# EAGLE design BMS Segment (EAGLE 7.7.0)
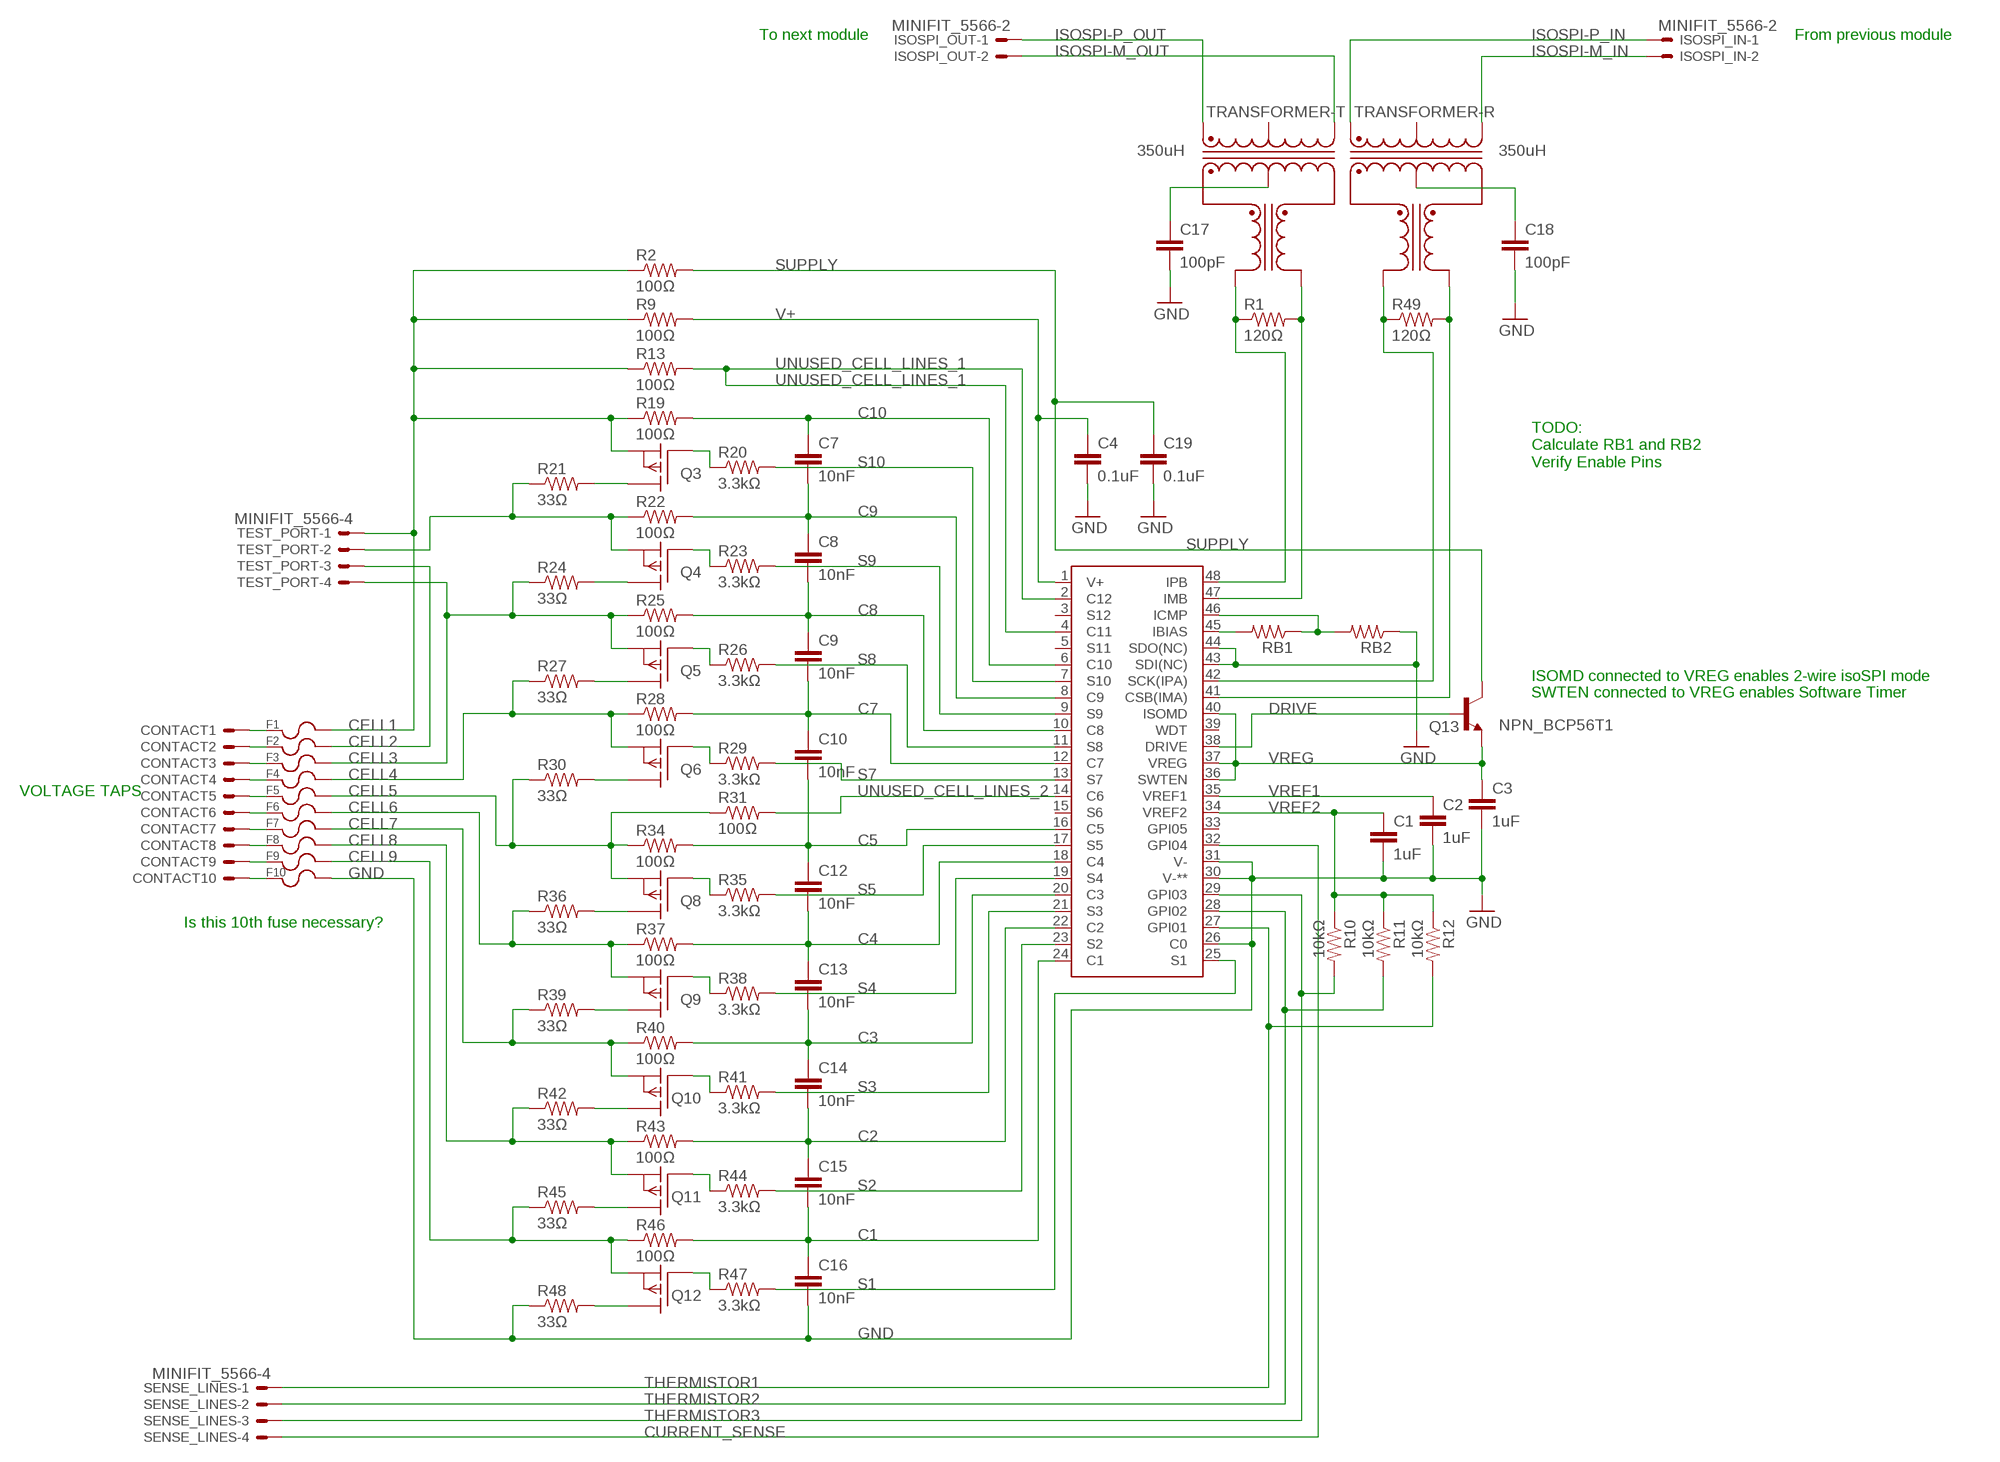
[diagram p0: schematic, sheet 1]

## Parts
C1  1uF  CAP0805  [0805]
C2  1uF  CAP0805  [0805]
C3  1uF  CAP0805  [0805]
C4  0.1uF  CAP0805  [0805]
C7  10nF  CAP0805  [0805]
C8  10nF  CAP0805  [0805]
C9  10nF  CAP0805  [0805]
C10  10nF  CAP0805  [0805]
C12  10nF  CAP0805  [0805]
C13  10nF  CAP0805  [0805]
C14  10nF  CAP0805  [0805]
C15  10nF  CAP0805  [0805]
C16  10nF  CAP0805  [0805]
C17  100pF  CAP0805  [0805]
C18  100pF  CAP0805  [0805]
C19  0.1uF  CAP0805  [0805]
CONTACT1  SPRING_CONTACT  [S1791-42R]
CONTACT2  SPRING_CONTACT  [S1791-42R]
CONTACT3  SPRING_CONTACT  [S1791-42R]
CONTACT4  SPRING_CONTACT  [S1791-42R]
CONTACT5  SPRING_CONTACT  [S1791-42R]
CONTACT6  SPRING_CONTACT  [S1791-42R]
CONTACT7  SPRING_CONTACT  [S1791-42R]
CONTACT8  SPRING_CONTACT  [S1791-42R]
CONTACT9  SPRING_CONTACT  [S1791-42R]
CONTACT10  SPRING_CONTACT  [S1791-42R]
F1  0751.0110_FUSE_CLIP  [0751.0110]
F2  0751.0110_FUSE_CLIP  [0751.0110]
F3  0751.0110_FUSE_CLIP  [0751.0110]
F4  0751.0110_FUSE_CLIP  [0751.0110]
F5  0751.0110_FUSE_CLIP  [0751.0110]
F6  0751.0110_FUSE_CLIP  [0751.0110]
F7  0751.0110_FUSE_CLIP  [0751.0110]
F8  0751.0110_FUSE_CLIP  [0751.0110]
F9  0751.0110_FUSE_CLIP  [0751.0110]
F10  0751.0110_FUSE_CLIP  [0751.0110]
ISOSPI_IN  MINIFIT_5566-2  [MINIFIT_5566-2]
ISOSPI_OUT  MINIFIT_5566-2  [MINIFIT_5566-2]
Q3  P-CHANNEL_MOSFET_DMP3099L-7  [SOT23]
Q4  P-CHANNEL_MOSFET_DMP3099L-7  [SOT23]
Q5  P-CHANNEL_MOSFET_DMP3099L-7  [SOT23]
Q6  P-CHANNEL_MOSFET_DMP3099L-7  [SOT23]
Q8  P-CHANNEL_MOSFET_DMP3099L-7  [SOT23]
Q9  P-CHANNEL_MOSFET_DMP3099L-7  [SOT23]
Q10  P-CHANNEL_MOSFET_DMP3099L-7  [SOT23]
Q11  P-CHANNEL_MOSFET_DMP3099L-7  [SOT23]
Q12  P-CHANNEL_MOSFET_DMP3099L-7  [SOT23]
Q13  NPN_BCP56T1  [SOT223]
R1  120Ω  RESISTOR0805-RES  [0805]
R2  100Ω  RESISTOR0805-RES  [0805]
R9  100Ω  RESISTOR0805-RES  [0805]
R10  10kΩ  RESISTOR0805-RES  [0805]
R11  10kΩ  RESISTOR0805-RES  [0805]
R12  10kΩ  RESISTOR0805-RES  [0805]
R13  100Ω  RESISTOR0805-RES  [0805]
R19  100Ω  RESISTOR0805-RES  [0805]
R20  3.3kΩ  RESISTOR0805-RES  [0805]
R21  33Ω  RESISTOR2512  [R2512]
R22  100Ω  RESISTOR0805-RES  [0805]
R23  3.3kΩ  RESISTOR0805-RES  [0805]
R24  33Ω  RESISTOR2512  [R2512]
R25  100Ω  RESISTOR0805-RES  [0805]
R26  3.3kΩ  RESISTOR0805-RES  [0805]
R27  33Ω  RESISTOR2512  [R2512]
R28  100Ω  RESISTOR0805-RES  [0805]
R29  3.3kΩ  RESISTOR0805-RES  [0805]
R30  33Ω  RESISTOR2512  [R2512]
R31  100Ω  RESISTOR0805-RES  [0805]
R34  100Ω  RESISTOR0805-RES  [0805]
R35  3.3kΩ  RESISTOR0805-RES  [0805]
R36  33Ω  RESISTOR2512  [R2512]
R37  100Ω  RESISTOR0805-RES  [0805]
R38  3.3kΩ  RESISTOR0805-RES  [0805]
R39  33Ω  RESISTOR2512  [R2512]
R40  100Ω  RESISTOR0805-RES  [0805]
R41  3.3kΩ  RESISTOR0805-RES  [0805]
R42  33Ω  RESISTOR2512  [R2512]
R43  100Ω  RESISTOR0805-RES  [0805]
R44  3.3kΩ  RESISTOR0805-RES  [0805]
R45  33Ω  RESISTOR2512  [R2512]
R46  100Ω  RESISTOR0805-RES  [0805]
R47  3.3kΩ  RESISTOR0805-RES  [0805]
R48  33Ω  RESISTOR2512  [R2512]
R49  120Ω  RESISTOR0805-RES  [0805]
RB1  RESISTOR0805-RES  [0805]
RB2  RESISTOR0805-RES  [0805]
SENSE_LINES  MINIFIT_5566-4  [MINIFIT_5566-4]
TEST_PORT  MINIFIT_5566-4  [MINIFIT_5566-4]
TRANSFORMER-  350uH  TRANSFORMER_749010013  [749010013]
U$2  LTC6804-1  [LTC6804]

## Nets
C1: C15.2 C16.1 R46.2 U$2.24(C1)
C2: C14.2 C15.1 R43.2 U$2.22(C2)
C3: C13.2 C14.1 R40.2 U$2.20(C3)
C4: C12.2 C13.1 R37.2 U$2.18(C4)
C5: C10.2 C12.1 R34.2 U$2.16(C5)
C7: C9.2 C10.1 R28.2 U$2.12(C7)
C8: C8.2 C9.1 R25.2 U$2.10(C8)
C9: C7.2 C8.1 R22.2 U$2.8(C9)
C10: C7.1 R19.2 U$2.6(C10)
CELL1: F1.R1 F1.R2 Q3.2(S) R2.1 R9.1 R13.1 R19.1 TEST_PORT.1
CELL2: F2.R1 F2.R2 Q4.2(S) R21.1 R22.1 TEST_PORT.2 TEST_PORT.3
CELL3: F3.R1 F3.R2 Q5.2(S) R24.1 R25.1 TEST_PORT.4
CELL4: F4.R1 F4.R2 Q6.2(S) R27.1 R28.1
CELL5: F5.R1 F5.R2 Q8.2(S) R30.1 R31.1 R34.1
CELL6: F6.R1 F6.R2 Q9.2(S) R36.1 R37.1
CELL7: F7.R1 F7.R2 Q10.2(S) R39.1 R40.1
CELL8: F8.R1 F8.R2 Q11.2(S) R42.1 R43.1
CELL9: F9.R1 F9.R2 Q12.2(S) R45.1 R46.1
CURRENT_SENSE: SENSE_LINES.4 U$2.32(GPI04)
DRIVE: Q13.1(BASE) U$2.38(DRIVE)
GND: C1.2 C2.2 C3.2 C4.2 C16.2 C17.2 C18.2 C19.2 F10.R1 F10.R2 R48.1 RB2.1 U$2.26(C0) U$2.30(V-**) U$2.31(V-) U$2.43(SDI(NC)) U$2.44(SDO(NC))
ISOSPI-M_IN: ISOSPI_IN.2 TRANSFORMER-.8(R:D-)
ISOSPI-M_OUT: ISOSPI_OUT.2 TRANSFORMER-.3(T:D-)
ISOSPI-P_IN: ISOSPI_IN.1 TRANSFORMER-.6(R:D+)
ISOSPI-P_OUT: ISOSPI_OUT.1 TRANSFORMER-.1(T:D+)
N$1: C18.1 TRANSFORMER-.10(R:CX)
N$2: C17.1 TRANSFORMER-.15(T:CX)
N$4: RB1.2 U$2.45(IBIAS)
N$5: R1.1 TRANSFORMER-.16(T:X+) U$2.48(IPB)
N$7: RB1.1 RB2.2 U$2.46(ICMP)
N$8: R49.1 TRANSFORMER-.11(R:X+) U$2.42(SCK(IPA))
N$9: R49.2 TRANSFORMER-.9(R:X-) U$2.41(CSB(IMA))
N$14: CONTACT1.P$1(S) F1.L1 F1.L2
N$15: Q3.1(G) R20.1
N$16: CONTACT2.P$1(S) F2.L1 F2.L2
N$17: CONTACT3.P$1(S) F3.L1 F3.L2
N$18: Q3.3(D) R21.2
N$19: CONTACT4.P$1(S) F4.L1 F4.L2
N$20: Q8.1(G) R35.1
N$22: Q9.1(G) R38.1
N$23: CONTACT5.P$1(S) F5.L1 F5.L2
N$24: CONTACT6.P$1(S) F6.L1 F6.L2
N$25: Q4.3(D) R24.2
N$26: CONTACT7.P$1(S) F7.L1 F7.L2
N$27: Q10.1(G) R41.1
N$28: Q11.1(G) R44.1
N$29: Q12.1(G) R47.1
N$30: Q5.3(D) R27.2
N$31: CONTACT8.P$1(S) F8.L1 F8.L2
N$32: CONTACT9.P$1(S) F9.L1 F9.L2
N$33: CONTACT10.P$1(S) F10.L1 F10.L2
N$36: Q6.3(D) R30.2
N$42: R1.2 TRANSFORMER-.14(T:X-) U$2.47(IMB)
N$43: Q8.3(D) R36.2
N$51: Q9.3(D) R39.2
N$53: Q10.3(D) R42.2
N$61: Q11.3(D) R45.2
N$66: Q12.3(D) R48.2
N$68: Q4.1(G) R23.1
N$69: Q5.1(G) R26.1
N$70: Q6.1(G) R29.1
S1: R47.2 U$2.25(S1)
S2: R44.2 U$2.23(S2)
S3: R41.2 U$2.21(S3)
S4: R38.2 U$2.19(S4)
S5: R35.2 U$2.17(S5)
S7: R29.2 U$2.13(S7)
S8: R26.2 U$2.11(S8)
S9: R23.2 U$2.9(S9)
S10: R20.2 U$2.7(S10)
SUPPLY: C19.1 Q13.2(COLLECTOR) Q13.4(COLLECTOR) R2.2
THERMISTOR1: R12.2 SENSE_LINES.1 U$2.27(GPI01)
THERMISTOR2: R11.2 SENSE_LINES.2 U$2.28(GPI02)
THERMISTOR3: R10.2 SENSE_LINES.3 U$2.29(GPI03)
UNUSED_CELL_LINES_1: R13.2 U$2.2(C12) U$2.4(C11)
UNUSED_CELL_LINES_2: R31.2 U$2.14(C6)
V+: C4.1 R9.2 U$2.1(V+)
VREF1: C2.1 U$2.35(VREF1)
VREF2: C1.1 R10.1 R11.1 R12.1 U$2.34(VREF2)
VREG: C3.1 Q13.3(EMITTER) U$2.36(SWTEN) U$2.37(VREG) U$2.40(ISOMD)
Unconnected: TRANSFORMER-.2(T:CD) TRANSFORMER-.7(R:CD) U$2.3(S12) U$2.5(S11) U$2.15(S6) U$2.33(GPI05) U$2.39(WDT)

## Notes on the sheet
- To next module | From previous module
- TODO:
  Calculate RB1 and RB2
  Verify Enable Pins
- ISOMD connected to VREG enables 2-wire isoSPI mode
- SWTEN connected to VREG enables Software Timer
- VOLTAGE TAPS
- Is this 10th fuse necessary?

## Library data of the parts
C1-C4 C7-C10 C12-C19 = HyTechDevices:CAP: Capacitor Standard 0603 ceramic capacitor, and 0.1" leaded capacitor.
CONTACT1-CONTACT10 = HyTechDevices:SPRING_CONTACT: Harwin Surface Mount Spring Contact Datasheet <http://www.mouser.com/ds/2/181/S1791-42R-351038.pdf>
F1-F10 = HyTechDevices:0751.0110_FUSE_CLIP: Schurter 0751.0110 Brass Fuse Clip Datasheet <http://www.mouser.com/ds/2/358/typ_OG__Clip__5x20-2553.pdf>
ISOSPI_IN ISOSPI_OUT = HyTechDevices:MINIFIT_5566-2: Mini-Fit Junior connector 2 pole Source: http://www.molex.com; OC_FARNELL: 1822072; OC_NEWARK: unknown
Q3-Q6 Q8-Q12 = HyTechDevices:P-CHANNEL_MOSFET_DMP3099L-7: Diodes Incorporated P-Channel Enhancement Mode MOSFET Datasheet <http://www.mouser.com/ds/2/115/DMP3099L-266220.pdf>
Q13 = HyTechDevices:NPN_BCP56T1: ON Semiconductor BCP56 Series NPN Silicon Epitaxial Transistor Datasheet <http://www.mouser.com/ds/2/308/BCP56T1-D-104805.pdf>
R1 R2 R9-R13 R19-R31 R34-R49 RB1 RB2 = HyTechDevices:RESISTOR: Resistor Basic schematic elements and footprints for 0603, 1206, and PTH resistors.
SENSE_LINES TEST_PORT = HyTechDevices:MINIFIT_5566-4: Mini-Fit Junior connector 4 pole Source: http://www.molex.com; OC_FARNELL: unknown; OC_NEWARK: unknown
TRANSFORMER- = HyTechDevices:TRANSFORMER_749010013: Wurth Electronics Midcom 749010013 10/100BaseTX Ethernet Transformer Datasheet <http://www.mouser.com/ds/2/445/749010013-311000.pdf> Mouser Page <http://www.mouser.com/ProductDetail/Wurth-Electronics-Midcom/749010013/?qs=40TFAHZMFvcjCZphxWYgVw%3D%3D>
U$2 = HyTechDevices:LTC6804-1

## Board
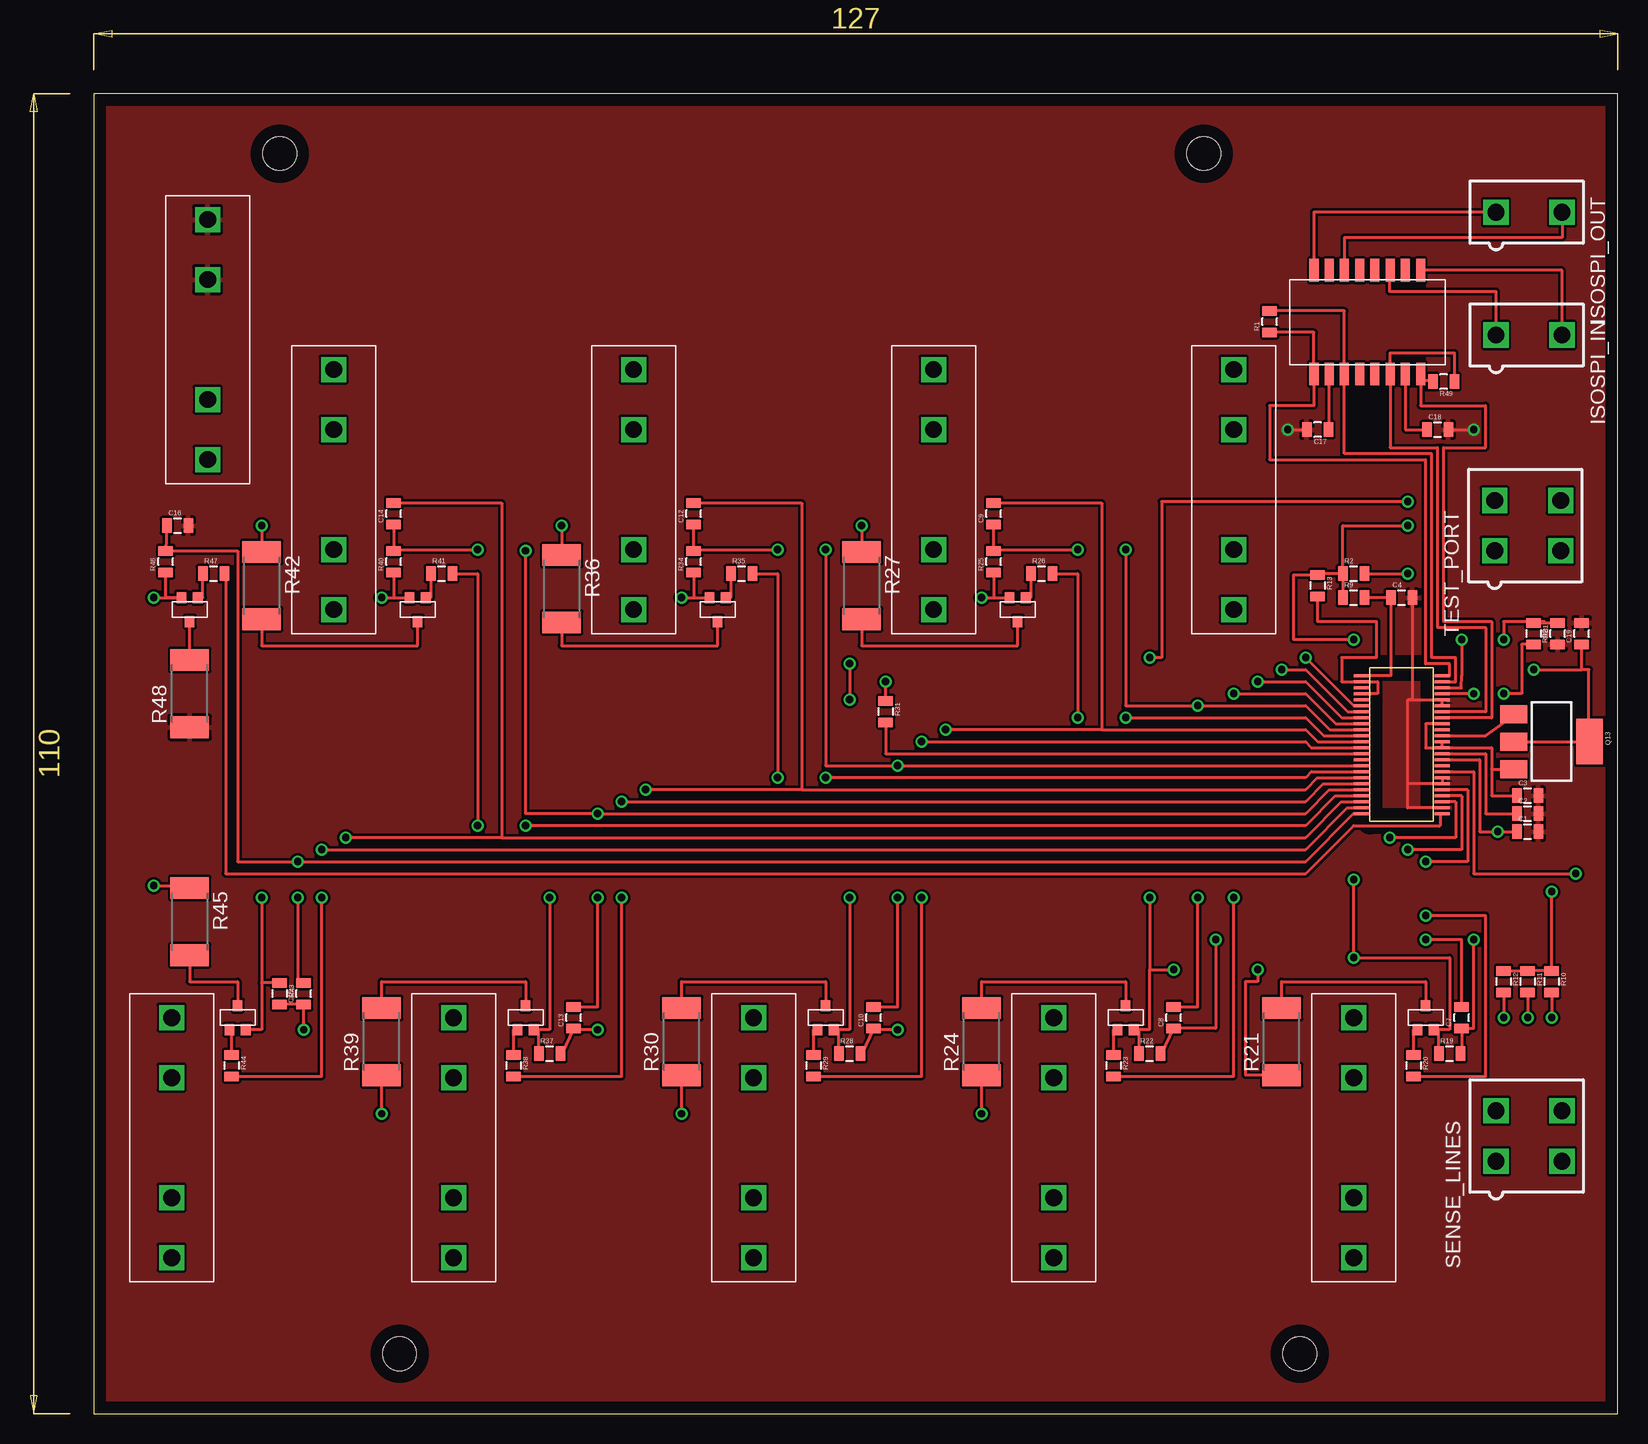
[diagram p1: board, top side]
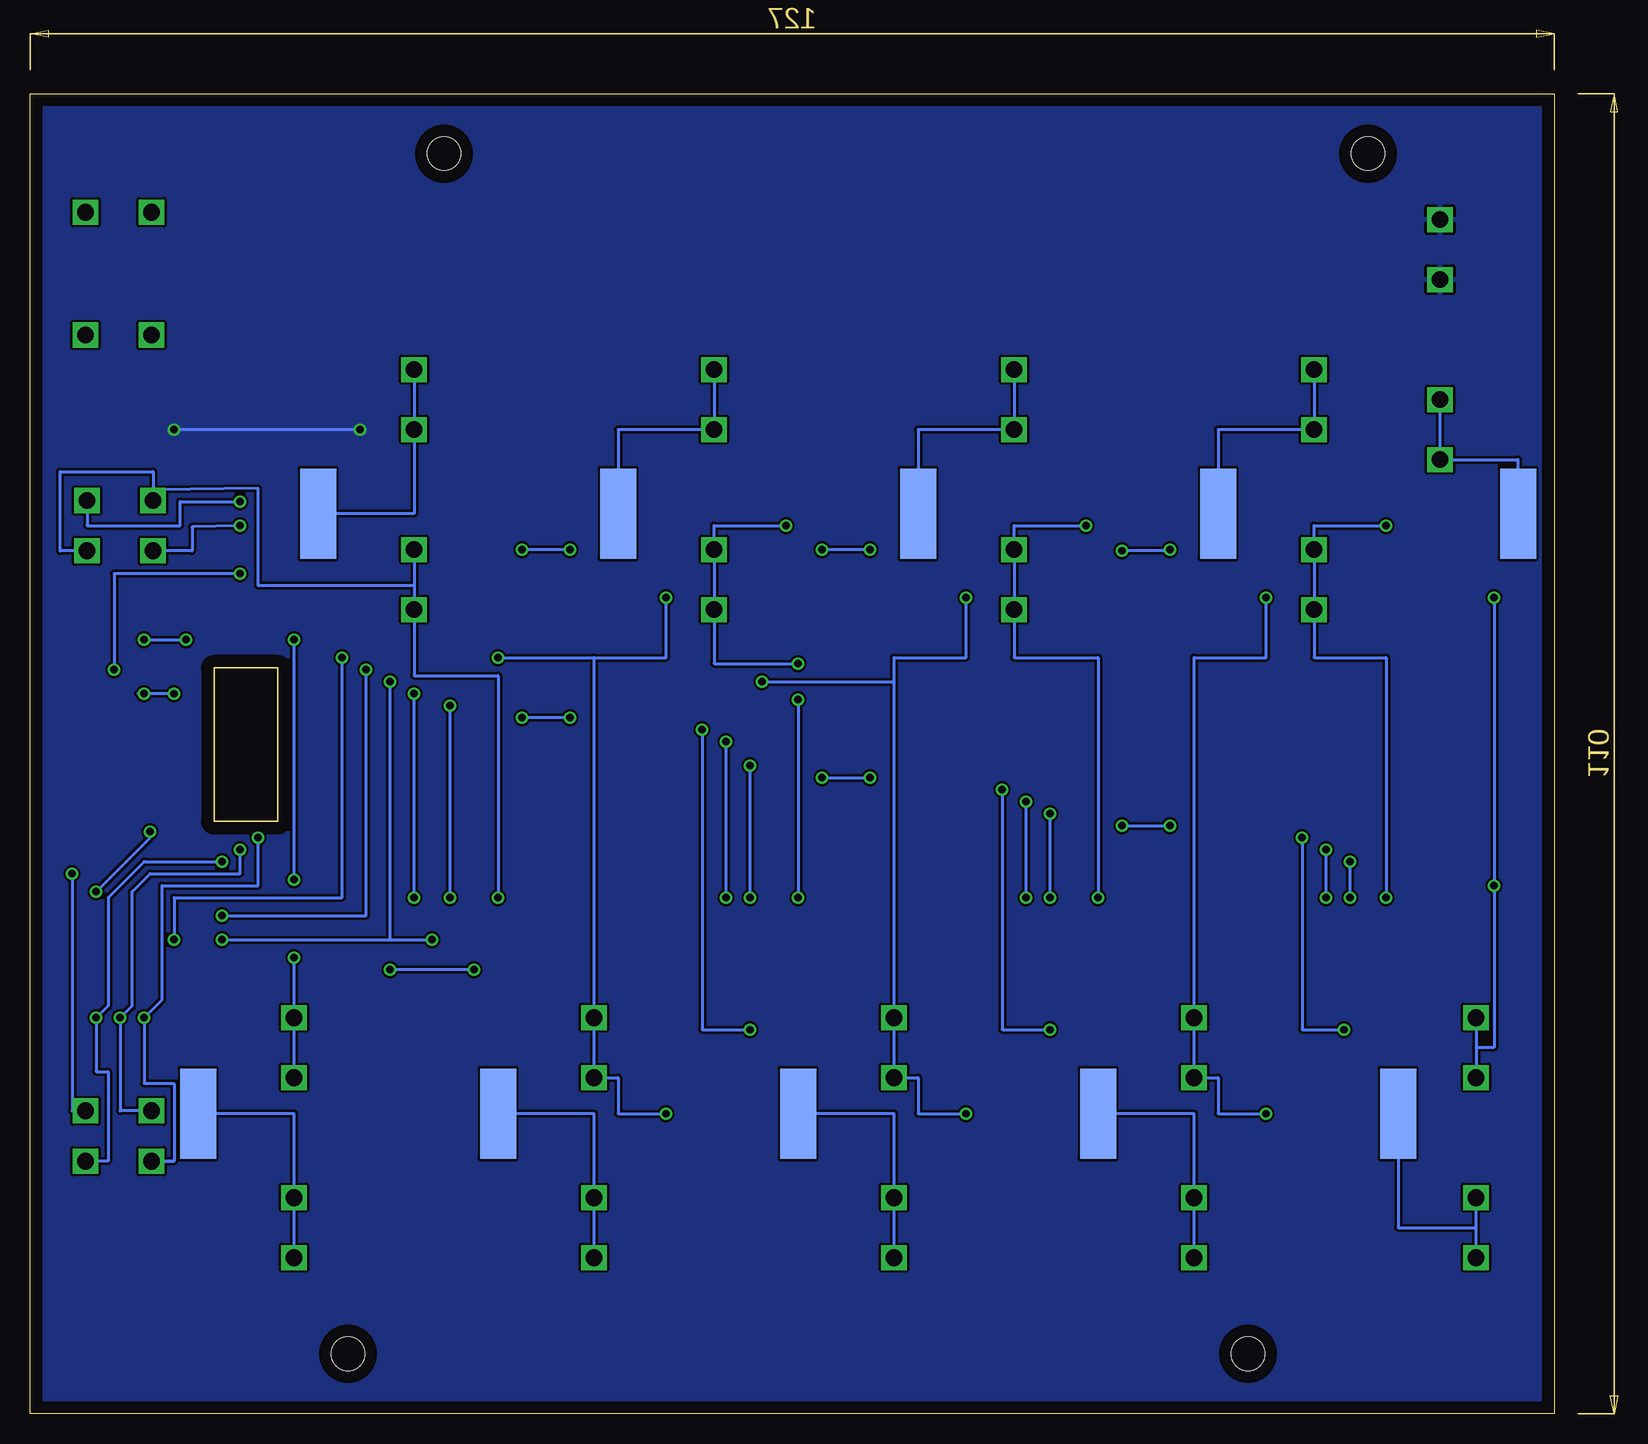
[diagram p2: board, bottom side, seen from below]

Size 127 x 110 mm. Coordinates in mm from the lower left corner, seen from the top.
Outline: 0,0 127,0 127,110 0,110 0,0
Copper layers (1*16): Top 0.035mm / dielectric 1.5mm / Bottom 0.035mm
Design rules "default": minimum track width 10mil, minimum drill 24mil, track to track 8mil, track to pad 8mil, pad to pad 8mil, via to via 8mil, smd to smd 8mil, copper to edge 40mil, drill to drill 8mil, minimum pad ring 10mil, minimum via ring 8mil, stop-mask expansion 4mil, vias tented up to drill 0mil, thermal gap 10mil
Holes 2.8 mm at 100.5,5 25.5,5 92.5,105 15.5,105

### Footprints (pad centres in the part's own frame; a part is rotated, then mirrored left to right if it is on the bottom)
0805 = smd 0.8 x 1.2: 1 -0.9,0; 2 0.9,0
S1791-42R = smd 7.5 x 3: P$1 0,0
0751.0110 = drill 1.4 square: L1 -10,0; L2 -5,0; R1 5,0; R2 10,0
MINIFIT_5566-2 = drill 1.4 square: 1 0,-2.75; 2 0,2.75
SOT23 = smd 0.8 x 0.9: 1 -0.675,-1; 2 0.675,-1; 3 0,1
SOT223 = smd 1.5 x 2.235: 1 -2.3,-3.15; 2 0,-3.15; 3 2.3,-3.15 | smd 3.8 x 2.2: 4 0,3.15
R2512 = smd 1.8 x 3.2: 1 -2.8,0; 2 2.8,0
MINIFIT_5566-4 = drill 1.4 square: 1 2.1,-2.75; 2 -2.1,-2.75; 3 2.1,2.75; 4 -2.1,2.75
749010013 = smd 1.905 x 0.762: 1 4.318,4.445; 2 4.318,3.175; 3 4.318,1.905; 4 4.318,0.635; 5 4.318,-0.635; 6 4.318,-1.905; 7 4.318,-3.175; 8 4.318,-4.445; 9 -4.318,-4.445; 10 -4.318,-3.175; 11 -4.318,-1.905; 12 -4.318,-0.635; 13 -4.318,0.635; 14 -4.318,1.905; 15 -4.318,3.175; 16 -4.318,4.445
LTC6804 = smd 0.25 x 1.25: 1 -5.75,-3.375; 2 -5.25,-3.375; 3 -4.75,-3.375; 4 -4.25,-3.375; 5 -3.75,-3.375; 6 -3.25,-3.375; 7 -2.75,-3.375; 8 -2.25,-3.375; 9 -1.75,-3.375; 10 -1.25,-3.375; 11 -0.75,-3.375; 12 -0.25,-3.375; 13 0.25,-3.375; 14 0.75,-3.375; 15 1.25,-3.375; 16 1.75,-3.375; 17 2.25,-3.375; 18 2.75,-3.375; 19 3.25,-3.375; 20 3.75,-3.375; 21 4.25,-3.375; 22 4.75,-3.375; 23 5.25,-3.375; 24 5.75,-3.375; 25 5.75,3.375; 26 5.25,3.375; 27 4.75,3.375; 28 4.25,3.375; 29 3.75,3.375; 30 3.25,3.375; 31 2.75,3.375; 32 2.25,3.375; 33 1.75,3.375; 34 1.25,3.375; 35 0.75,3.375; 36 0.25,3.375; 37 -0.25,3.375; 38 -0.75,3.375; 39 -1.25,3.375; 40 -1.75,3.375; 41 -2.25,3.375; 42 -2.75,3.375; 43 -3.25,3.375; 44 -3.75,3.375; 45 -4.25,3.375; 46 -4.75,3.375; 47 -5.25,3.375; 48 -5.75,3.375

### Placement (x,y rotation side)
C1  119.5,48.5 0 top
C2  119.5,50 0 top
C3  119.5,51.5 0 top
C4  109,68 0 top
C7  114,33 90 top
C8  90,33 90 top
C9  75,75 90 top
C10  65,33 90 top
C12  50,75 90 top
C13  40,33 90 top
C14  25,75 90 top
C15  17.5,35 90 top
C16  7,74 0 top
C17  102,82 180 top
C18  112,82 0 top
C19  124,65 90 top
CONTACT1  113,25 270 bottom
CONTACT2  103,75 270 bottom
CONTACT3  88,25 90 bottom
CONTACT4  78,75 90 bottom
CONTACT5  63,25 90 bottom
CONTACT6  53,75 270 bottom
CONTACT7  38,25 270 bottom
CONTACT8  28,75 90 bottom
CONTACT9  13,25 90 bottom
CONTACT10  3,75 90 bottom
F1  105,23 90 top
F2  95,77 270 top
F3  80,23 90 top
F4  70,77 270 top
F5  55,23 90 top
F6  45,77 270 top
F7  30,23 90 top
F8  20,77 270 top
F9  6.5,23 90 top
F10  9.5,89.5 90 top
ISOSPI_IN  119.62,89.88 270 top
ISOSPI_OUT  119.62,100.12 270 top
Q3  111,33 0 top
Q4  86,33 0 top
Q5  77,67 180 top
Q6  61,33 0 top
Q8  52,67 180 top
Q9  36,33 0 top
Q10  27,67 180 top
Q11  12,33 0 top
Q12  8,67 180 top
Q13  121.5,56 270 top
R1  98,91 90 top
R2  105,70 0 top
R9  105,68 0 top
R10  121.5,36 270 top
R11  119.5,36 270 top
R12  117.5,36 270 top
R13  102,69 270 top
R19  113,30 0 top
R20  110,29 270 top
R21  99,31 90 top
R22  88,30 0 top
R23  85,29 270 top
R24  74,31 90 top
R25  75,71 90 top
R26  79,70 0 top
R27  64,69 270 top
R28  63,30 0 top
R29  60,29 270 top
R30  49,31 90 top
R31  66,58.5 270 top
R34  50,71 90 top
R35  54,70 0 top
R36  39,68.74 270 top
R37  38,30 0 top
R38  35,29 270 top
R39  24,31 90 top
R40  25,71 90 top
R41  29,70 0 top
R42  14,69 270 top
R43  15.5,35 270 top
R44  11.5,29 270 top
R45  8,41 270 top
R46  6,71 90 top
R47  10,70 0 top
R48  8,60 90 top
R49  112.5,86 180 top
RB1  120,65 270 top
RB2  122,65 90 top
SENSE_LINES  119.62,23.13 270 top
TEST_PORT  119.5,74 270 top
TRANSFORMER-  106.14,90.95 90 top
U$2  109,55.75 270 top

### Tracks (layer width: path | path; a pad name or v marks a point on that pad's centre or on a via)
C1  (via drill 0.6)
  Top 0.254: C16.1 R46.2 12,71.9 12,46 v17,46 101,46 104.98,49.98 105.62,49.98 U$2.24 | v17,43 17,35.9 C15.2
  Bottom 0.254: v17,43 v17,46
C2  (via drill 0.6)
  Top 0.254: C14.2 34,75.9 34,48 | 34,48 101,48 103.98,50.98 105.62,50.98 U$2.22 | 34,48 v21,48 | v17.5,32 C15.1 R43.2
  Bottom 0.254: v21,48 21,32 v17.5,32
C3  (via drill 0.6)
  Top 0.254: C14.1 R40.2 25,72 v32,72 | C13.2 42,33.9 v42,43 | v36,71.9 36,50 v42,50 101,50 102.98,51.98 105.62,51.98 U$2.20
  Bottom 0.254: v42,43 v42,50 | v32,72 32,71.9 v36,71.9
C4  (via drill 0.6)
  Top 0.254: R37.2 39,30 C13.1 40,32 v42,32 | C12.2 59,75.9 59,52 | 59,52 101,52 101.98,52.98 105.62,52.98 U$2.18 | 59,52 v46,52
  Bottom 0.254: v46,52 46,32 v42,32
C5  (via drill 0.6)
  Top 0.254: C12.1 R34.2 50,72 v57,72 | C10.2 67,33.9 v67,43 | U$2.16 v67,54 61,54 v61,72
  Bottom 0.254: v67,43 v67,54 | v57,72 v61,72
C7  (via drill 0.6)
  Top 0.254: R28.2 64,30 C10.1 65,32 v67,32 | C9.2 84,75.9 84,57 | 84,57 101,57 102.02,55.98 105.62,55.98 U$2.12 | 84,57 v71,57
  Bottom 0.254: v71,57 71,32 v67,32
C8  (via drill 0.6)
  Top 0.254: C9.1 R25.2 75,72 v82,72 | C8.2 92,33.9 v92,43 | v86,72 86,59 v92,59 101,59 103.02,56.98 105.62,56.98 U$2.10
  Bottom 0.254: v92,43 v92,59 | v82,72 v86,72
C9  (via drill 0.6)
  Top 0.254: R22.2 89,30 C8.1 93.5,32.1 v93.5,39.5 | C7.2 114,39.5 v111,39.5 | v97,61 101,61 104.02,57.98 105.62,57.98 U$2.8
  Bottom 0.254: v111,39.5 97,39.5 | 97,39.5 v97,61 | 97,39.5 v93.5,39.5
C10  (via drill 0.6)
  Top 0.254: R19.2 114,30 C7.1 115,32.1 v115,39.5 | v101,63 105.02,58.98 105.62,58.98 U$2.6
  Bottom 0.254: v101,63 101,43 115,43 v115,39.5
CELL1  (via drill 0.6)
  Top 0.254: R19.1 112.1,32 Q3.2 113,32 113,38 v105,38 v105,44.5 | 104,68 R9.1 R2.1 | R2.1 102,70 R13.1 100,69.9 100,64.5 v105,64.5 | R2.1 104.1,74 v109.5,74
  Bottom 0.254: F1.R1 F1.R2 v105,38 | v105,44.5 v105,64.5 | v109.5,74 113.5,73.9 113.5,71.9 TEST_PORT.1
CELL2  (via drill 0.6)
  Top 0.254: R22.1 87.1,32 Q4.2 88,32 88,37 | v88,43 88,37 | 88,37 v90,37 | R21.1 96,28.2 96,36 97,36 v97,37
  Bottom 0.254: v88,43 88,61.5 95,61.5 F2.R2 F2.R1 95,69 108,69 108,77.1 116.5,77 116.75,77 | v90,37 v97,37 | 116.75,77 TEST_PORT.2 | TEST_PORT.3 124.5,71.9 124.5,78.5 116.75,78.5 116.75,77
CELL3  (via drill 0.6)
  Top 0.254: R25.1 75,68 | 75,68 Q5.2 | v74,25 R24.1 | v74,68 75,68 | v109.5,76 89,76 89,63 v88,63
  Bottom 0.254: v74,25 78,25 78,28 F3.R1 F3.R2 80,63 | 80,63 74,63 v74,68 | TEST_PORT.4 122.25,74 114.5,74 114.5,76 v109.5,76 | v88,63 80,63
CELL4  (via drill 0.6)
  Top 0.254: R28.1 62.1,32 Q6.2 63,32 v63,43 | v64,74 R27.1 | v63,62.5 v63,59.5
  Bottom 0.254: v64,74 70,74 F4.R1 F4.R2 70,62.5 v63,62.5 | v63,59.5 v63,43
CELL5  (via drill 0.6)
  Top 0.254: R34.1 50,68 Q8.2 v49,68 | v49,25 R30.1 | R31.1 v66,61
  Bottom 0.254: v49,25 53,25 53,28 F5.R1 F5.R2 55,61 | 55,61 55,63 49,63 v49,68 | v66,61 55,61
CELL6  (via drill 0.6)
  Top 0.254: R37.1 37.1,32 Q9.2 38,32 v38,43 | v39,74 R36.1
  Bottom 0.254: v39,74 45,74 F6.R1 F6.R2 45,63 38,63 v38,43
CELL7  (via drill 0.6)
  Top 0.254: R40.1 25,68 Q10.2 v24,68 | v24,25 R39.1
  Bottom 0.254: v24,25 28,25 28,28 F7.R1 F7.R2 30,63 24,63 v24,68
CELL8  (via drill 0.6)
  Top 0.254: v14,74 R42.1 | v14,43 14,35.9 | 14,35.9 14,32 Q11.2 | R43.1 14,35.9
  Bottom 0.254: v14,74 20,74 F8.R1 F8.R2 20,63 14,63 v14,43
CELL9  (via drill 0.6)
  Top 0.254: R46.1 6,68 Q12.2 v5,68 | v5,44 8,44 R45.1
  Bottom 0.254: v5,68 v5,44 5,30.5 6.5,30.5 | F9.R2 6.5,30.5 | 6.5,30.5 F9.R1
CURRENT_SENSE  (via drill 0.6)
  Top 0.254: 113.22,53.5 U$2.32 115,53.5 115,45 v123.5,45
  Bottom 0.254: v123.5,45 123.5,25.23 SENSE_LINES.4
DRIVE
  Top 0.254: 113.22,56.5 U$2.38 116,56.5 118.5,58.3 Q13.1
GND  (via drill 0.6)
  Top 0.254: C4.2 109.9,59.48 109.5,59.48 | 109.5,59.48 U$2.44 U$2.43 | U$2.31 U$2.30 109.5,52.48 | 109.5,52.48 109.5,59.48 | U$2.26 109.5,50.48 109.5,52.48 | v99.5,82 101,82 | C18.2 v115,82
  Bottom 0.254: v99.5,82 v115,82
  pour Top: -2,112 129,112 129,-2 -2,-2
  pour Bottom: -1,111 128,111 128,-1 -1,-1
ISOSPI-M_IN
  Top 0.254: ISOSPI_IN.2 122.37,95.27 TRANSFORMER-.8
ISOSPI-M_OUT
  Top 0.254: ISOSPI_OUT.2 122.37,98 104.23,98 TRANSFORMER-.3
ISOSPI-P_IN
  Top 0.254: ISOSPI_IN.1 116.87,93.5 108,93.5 108,95.27 TRANSFORMER-.6
ISOSPI-P_OUT
  Top 0.254: ISOSPI_OUT.1 101.69,100.12 TRANSFORMER-.1
N$1
  Top 0.254: TRANSFORMER-.10 109.31,82 C18.1
N$2
  Top 0.254: C17.1 102.97,82 TRANSFORMER-.15
N$4  (via drill 0.6)
  Top 0.254: RB1.2 119,64.1 119,60 v117.5,60 | v115,59.98 U$2.45
  Bottom 0.254: v115,59.98 118,60 v117.5,60
N$5
  Top 0.254: R1.1 101.69,90.1 TRANSFORMER-.16 101.69,84 98,84 98,79.5 111,79.5 111,62.48 113,62.48 113,61.48 U$2.48
N$7  (via drill 0.6)
  Top 0.254: RB2.2 RB1.1 120.9,66 117.5,66 v117.5,64.5 | U$2.46 113.98,60.48 114,61.5 v114,64.5
  Bottom 0.254: v117.5,64.5 v114,64.5
N$8
  Top 0.254: U$2.42 116,58.48 116,65.5 112,65.5 112,80.5 108.05,80.5 TRANSFORMER-.11 108.05,88.4 113.4,88.4 R49.1
N$9
  Top 0.254: TRANSFORMER-.9 110.58,86.1 | 110.58,86.1 110.58,84 116,84 116,80.5 112.5,80.5 112.5,66 116.5,66 116.5,57.98 U$2.41 | 110.58,86.1 111.6,86.1 R49.2
N$14
  Bottom 0.254: F1.L1 F1.L2 105,25 CONTACT1.P$1
N$15
  Top 0.254: R20.1 110,32 Q3.1
N$16
  Bottom 0.254: F2.L1 F2.L2 95,75 CONTACT2.P$1
N$17
  Bottom 0.254: F3.L1 F3.L2 80,25 CONTACT3.P$1
N$18
  Top 0.254: R21.2 99,36 111,36 Q3.3
N$19
  Bottom 0.254: F4.L1 F4.L2 78,82 CONTACT4.P$1
N$20
  Top 0.254: R35.1 53.1,68 Q8.1
N$22
  Top 0.254: R38.1 35,32 Q9.1
N$23
  Bottom 0.254: F5.L1 F5.L2 55,25 CONTACT5.P$1
N$24
  Bottom 0.254: F6.L1 F6.L2 53,82 CONTACT6.P$1
N$25
  Top 0.254: R24.2 74,36 86,36 Q4.3
N$26
  Bottom 0.254: F7.L1 F7.L2 30,25 CONTACT7.P$1
N$27
  Top 0.254: R41.1 28.1,68 Q10.1
N$28
  Top 0.254: R44.1 11.5,32 Q11.1
N$29
  Top 0.254: Q12.1 9.1,68 R47.1
N$30
  Top 0.254: R27.2 64,64 77,64 Q5.3
N$31
  Bottom 0.254: F8.L1 F8.L2 28,82 CONTACT8.P$1
N$32
  Bottom 0.254: F9.L1 6.5,15.5 | 6.5,15.5 F9.L2 | CONTACT9.P$1 13,15.5 6.5,15.5
N$33
  Bottom 0.254: F10.L2 F10.L1 3,79.5 CONTACT10.P$1
N$36
  Top 0.254: R30.2 49,36 61,36 Q6.3
N$42
  Top 0.254: R1.2 104.23,91.9 TRANSFORMER-.14 104.23,80 111.5,80 111.5,63 113.5,63 113.5,60.98 U$2.47
N$43
  Top 0.254: R36.2 39,64 52,64 Q8.3
N$51
  Top 0.254: R39.2 24,36 36,36 Q9.3
N$53
  Top 0.254: R42.2 14,64 27,64 Q10.3
N$61
  Top 0.254: R45.2 8,36 12,36 Q11.3
N$66
  Top 0.254: R48.2 Q12.3
N$68
  Top 0.254: R23.1 85,32 Q4.1
N$69
  Top 0.254: R26.1 78.1,68 Q5.1
N$70
  Top 0.254: R29.1 60,32 Q6.1
S1
  Top 0.254: U$2.25 112.22,50 112.22,49 105,49 101,45 11,45 11,70 R47.2
S2  (via drill 0.6)
  Top 0.254: R44.2 19,28.1 v19,43 | v19,47 101,47 104.48,50.48 105.62,50.48 U$2.23
  Bottom 0.254: v19,43 v19,47
S3  (via drill 0.6)
  Top 0.254: R41.2 32,70 v32,49 | v36,49 101,49 103.48,51.48 105.62,51.48 U$2.21
  Bottom 0.254: v36,49 v32,49
S4  (via drill 0.6)
  Top 0.254: R38.2 44,28.1 v44,43 | v44,51 101,51 102.48,52.48 105.62,52.48 U$2.19
  Bottom 0.254: v44,43 v44,51
S5  (via drill 0.6)
  Top 0.254: R35.2 57,70 v57,53 | v61,53 101,53 101.48,53.48 101.48,53.5 U$2.17
  Bottom 0.254: v61,53 v57,53
S7  (via drill 0.6)
  Top 0.254: R29.2 69,28.1 v69,43 | v69,56 101,56 101.48,55.48 105.62,55.48 U$2.13
  Bottom 0.254: v69,43 v69,56
S8  (via drill 0.6)
  Top 0.254: R26.2 82,70 v82,58 | v86,58 101,58 102.52,56.48 105.62,56.48 U$2.11
  Bottom 0.254: v82,58 v86,58
S9  (via drill 0.6)
  Top 0.254: R23.2 95,28.1 v95,43 | v95,60 101,60 103.52,57.48 105.62,57.48 U$2.9
  Bottom 0.254: v95,43 v95,60
S10  (via drill 0.6)
  Top 0.254: R20.2 116,28.1 116,41.5 v111,41.5 | v99,62 101,62 104.52,58.48 105.62,58.48 U$2.7
  Bottom 0.254: v111,41.5 99,41.5 v99,62
SUPPLY  (via drill 0.6)
  Top 0.254: Q13.2 124.6,56 | 124.6,56 Q13.4 | R2.2 v109.5,70 | v120,62 124,62 | 124,62 C19.1 | 124.6,56 124.6,62 124,62
  Bottom 0.254: v109.5,70 120,70 v120,62
THERMISTOR1  (via drill 0.6)
  Top 0.254: R12.2 v117.5,33 | U$2.27 113.5,50.98 113.5,48 v108,48
  Bottom 0.254: 115,21.03 115,27.5 117.5,27.5 v117.5,33 116,34.5 116,44 108,44 v108,48 | 116,21 115,21.03 | 115,21.03 SENSE_LINES.1
THERMISTOR2  (via drill 0.6)
  Top 0.254: R11.2 v119.5,33 | U$2.28 114,51.48 114,47 v109.5,47
  Bottom 0.254: SENSE_LINES.2 119.5,25.23 v119.5,33 118.5,34 118.5,43.5 117,45 109.5,45 v109.5,47
THERMISTOR3  (via drill 0.6)
  Top 0.254: R10.2 v121.5,33 | U$2.29 114.5,51.98 114.5,46 v111,46
  Bottom 0.254: v111,46 117.5,46 120.5,43 120.5,34 v121.5,33 121.5,28.5 120.5,28.5 120.5,21.03 SENSE_LINES.3
UNUSED_CELL_LINES_1
  Top 0.254: 106.4,59.98 U$2.4 107,60 107,61 U$2.2 | 106.4,60.98 U$2.2 | R13.2 102,66 106.9,66 106.9,63 104,63 104,61 U$2.2
UNUSED_CELL_LINES_2
  Top 0.254: R31.2 66,55 U$2.14
V+
  Top 0.254: R9.2 C4.1 108.1,61.5 U$2.1
VREF1
  Top 0.254: 113.22,55 U$2.35 116,55 116,50 C2.1
VREF2  (via drill 0.6)
  Top 0.254: 113.22,54.5 U$2.34 115.5,54.5 115.5,48.5 v117,48.5 C1.1 | R12.1 R11.1 R10.1 v121.5,43.5
  Bottom 0.254: v121.5,43.5 117,48 v117,48.5
VREG
  Top 0.254: U$2.36 U$2.37 | U$2.36 113.22,55.5 | U$2.36 116.5,55.5 116.5,53.7 | 116.5,53.7 Q13.3 | 116.5,53.7 116.5,51.5 C3.1 | U$2.40 111,57.48 111,55.48 U$2.36